# EAGLE design carcomputer (EAGLE 9.6.2)
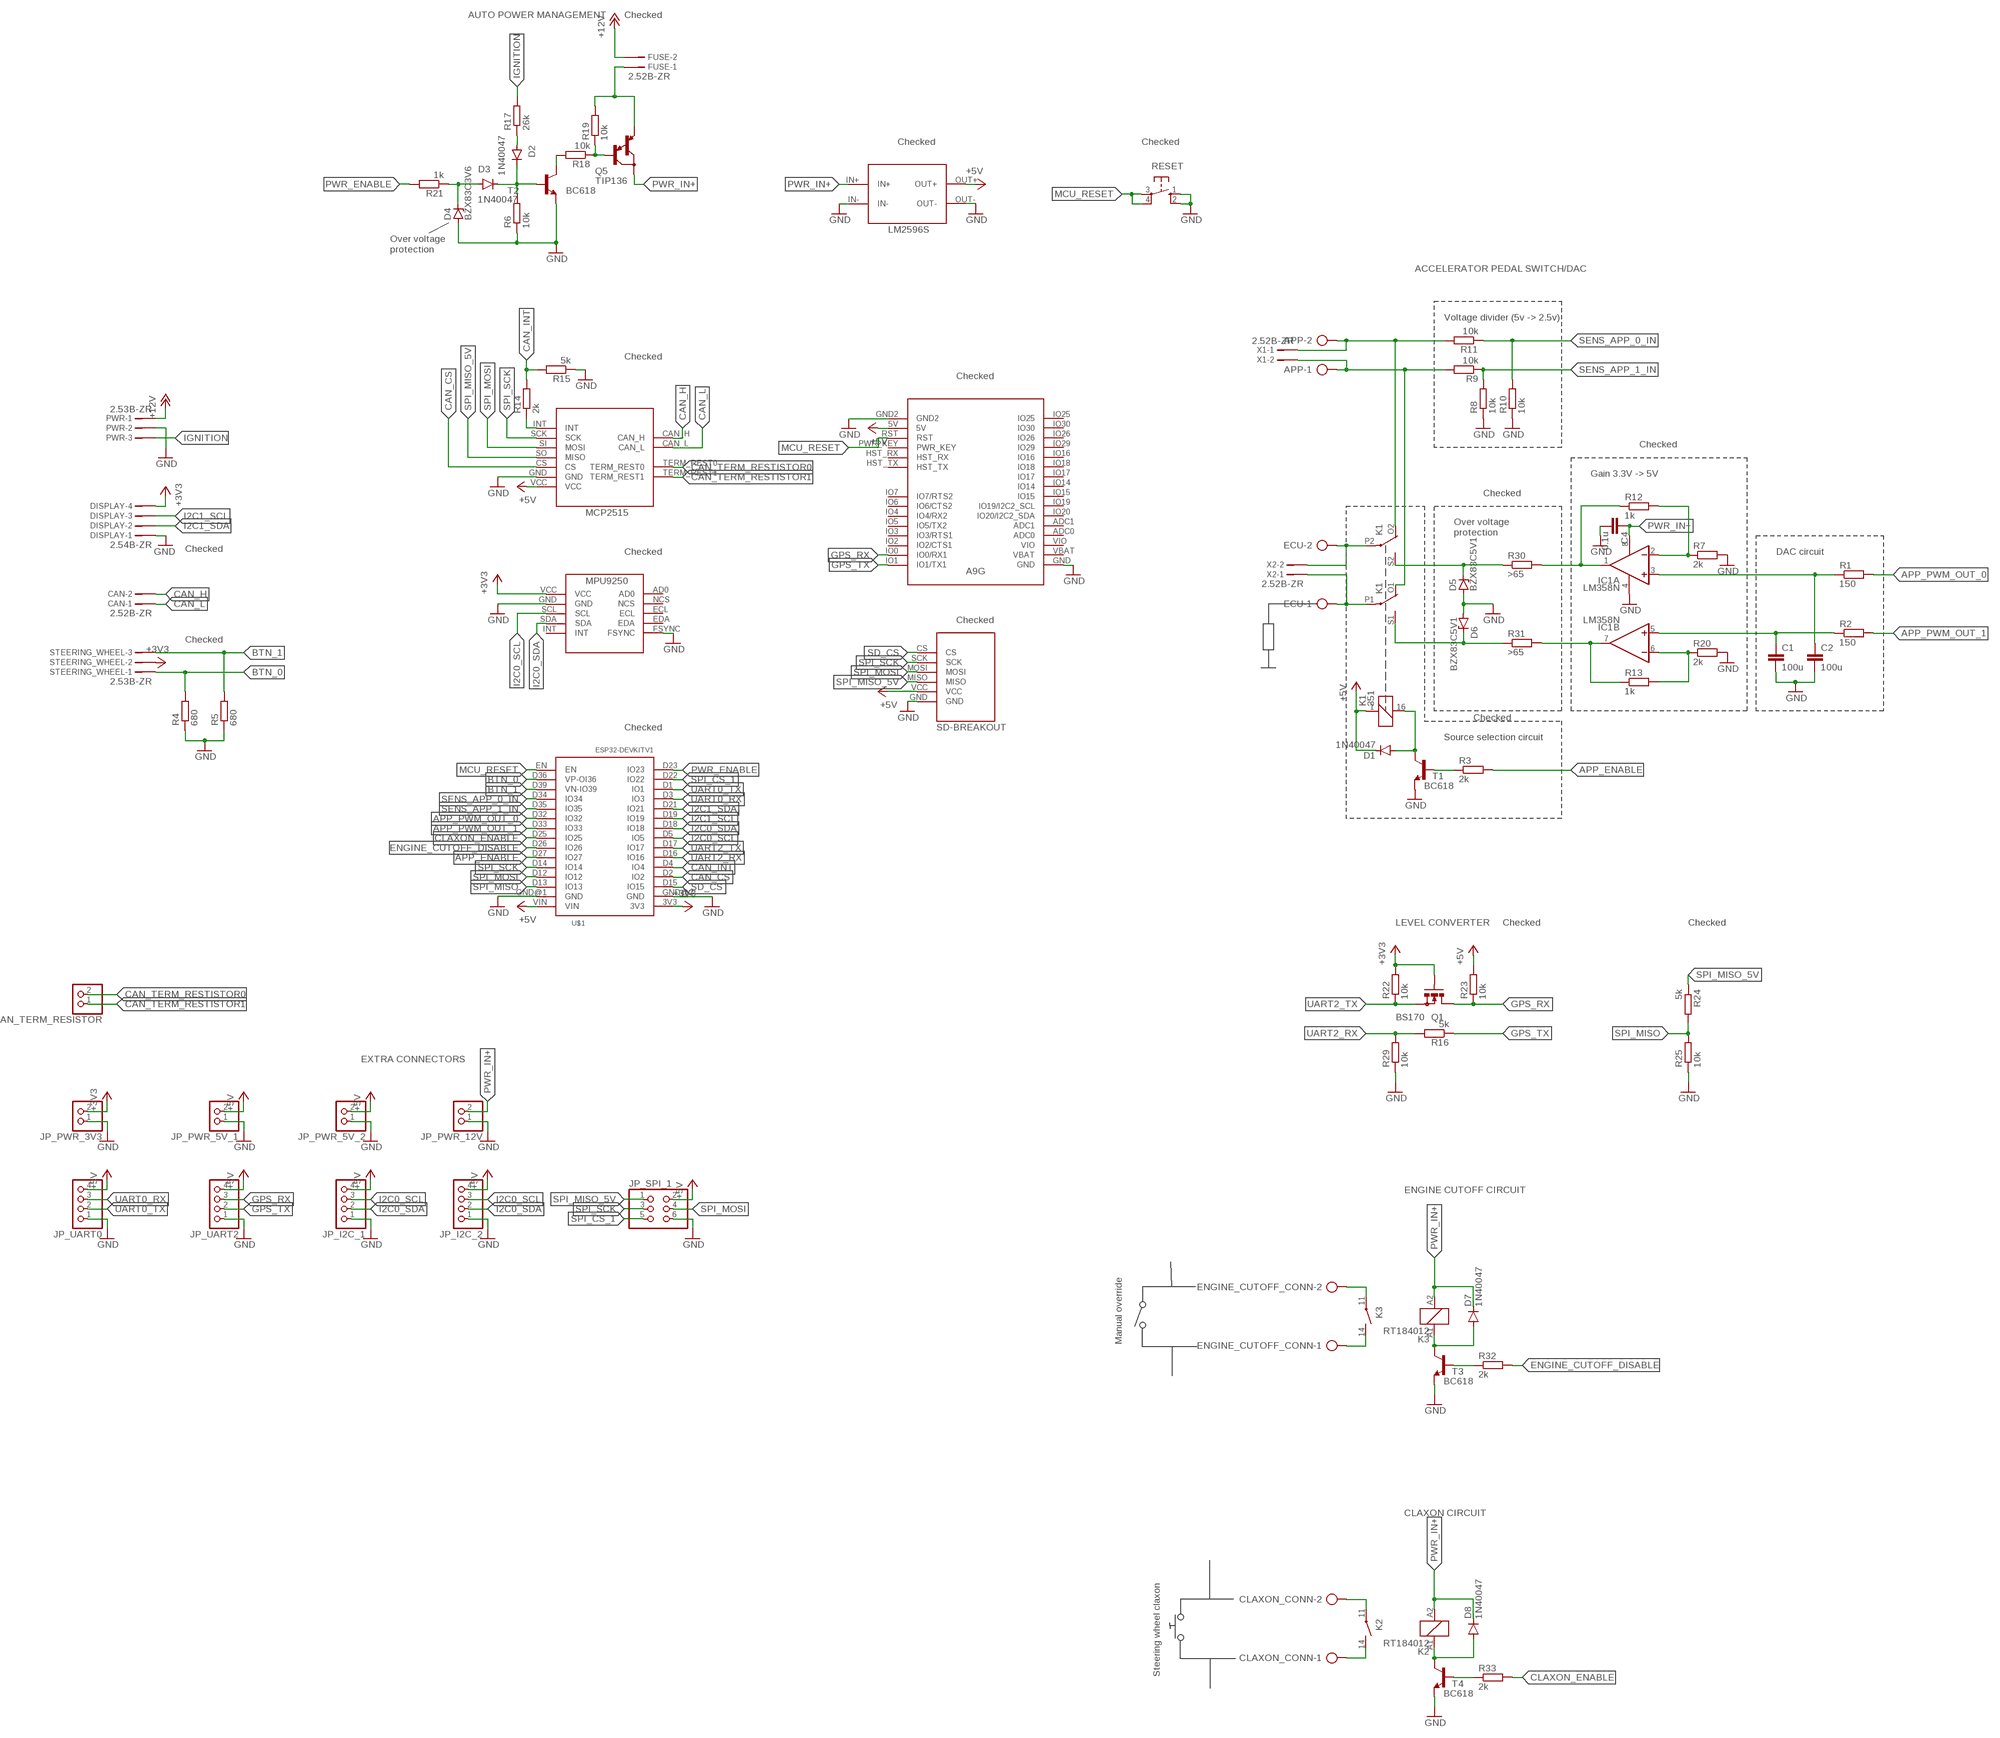
[diagram p0: schematic, sheet 1]

## Parts
APP  AK300/2  [AK300/2]
C1  100u  C-EU025-050X050  [C025-050X050]
C2  100u  C-EU025-050X050  [C025-050X050]
C4  0.1u  C-EU025-050X050  [C025-050X050]
CAN  2.52B-ZR  [B2B-ZR2.5]
CAN_TERM_RESISTOR  PINHD-1X2  [1X02]
CLAXON_CONN  AK300/2  [AK300/2]
D1  1N40047  [DO41-7.6]
D2  1N40047  [DO41-7.6]
D3  1N40047  [DO41-7.6]
D4  BZX83C3V6  BZX857  [DO41Z7.6]
D5  BZX83C5V1  BZX857  [DO41Z7.6]
D6  BZX83C5V1  BZX857  [DO41Z7.6]
D7  1N40047  [DO41-7.6]
D8  1N40047  [DO41-7.6]
DISPLAY  2.54B-ZR  [B4B-ZR2.5]
ECU  AK300/2  [AK300/2]
ENGINE_CUTOFF_CONN  AK300/2  [AK300/2]
FUSE  2.52B-ZR  [B2B-ZR2.5]
IC1  LM358N  [DIL08]
JP_I2C_1  PINHD-1X4  [1X04]
JP_I2C_2  PINHD-1X4  [1X04]
JP_PWR_3V3  PINHD-1X2  [1X02]
JP_PWR_5V_1  PINHD-1X2  [1X02]
JP_PWR_5V_2  PINHD-1X2  [1X02]
JP_PWR_12V  PINHD-1X2  [1X02]
JP_SPI_1  PINHD-2X3  [2X03]
JP_UART0  PINHD-1X4  [1X04]
JP_UART2  PINHD-1X4  [1X04]
K1  351  [351]
K2  RT184012  [RT-N/O12A3.5]
K3  RT184012  [RT-N/O12A3.5]
PWR  2.53B-ZR  [B3B-ZR2.5]
Q1  BS170  [SOT54E]
Q5  TIP136  [TO220]
R1  150  R-EU_0309/10  [0309/10]
R2  150  R-EU_0309/10  [0309/10]
R3  2k  R-EU_0207/7  [0207/7]
R4  680  R-EU_0207/7  [0207/7]
R5  680  R-EU_0207/7  [0207/7]
R6  10k  R-EU_0207/7  [0207/7]
R7  2k  R-EU_0207/7  [0207/7]
R8  10k  R-EU_0207/7  [0207/7]
R9  10k  R-EU_0309/10  [0309/10]
R10  10k  R-EU_0207/7  [0207/7]
R11  10k  R-EU_0309/10  [0309/10]
R12  1k  R-EU_0207/7  [0207/7]
R13  1k  R-EU_0207/7  [0207/7]
R14  2k  R-EU_0309/10  [0309/10]
R15  5k  R-EU_0207/7  [0207/7]
R16  5k  R-EU_0207/7  [0207/7]
R17  26k  R-EU_0207/7  [0207/7]
R18  10k  R-EU_0207/7  [0207/7]
R19  10k  R-EU_0207/7  [0207/7]
R20  2k  R-EU_0207/7  [0207/7]
R21  1k  R-EU_0309/10  [0309/10]
R22  10k  R-EU_0207/7  [0207/7]
R23  10k  R-EU_0207/7  [0207/7]
R24  5k  R-EU_0207/7  [0207/7]
R25  10k  R-EU_0207/7  [0207/7]
R29  10k  R-EU_0207/7  [0207/7]
R30  >65  R-EU_0207/7  [0207/7]
R31  >65  R-EU_0207/7  [0207/7]
R32  2k  R-EU_0309/10  [0309/10]
R33  2k  R-EU_0309/10  [0309/10]
RESET  10-XX  [B3F-10XX]
STEERING_WHEEL  2.53B-ZR  [B3B-ZR2.5]
T1  BC618  [TO92-EBC]
T2  BC618  [TO92-EBC]
T3  BC618  [TO92-EBC]
T4  BC618  [TO92-EBC]
U$1  ESP32DEVKITV1  [ESP32-DEVKITV1]
U$2  MCP2515_DEVBOARDINVERTED  [MCP2515_DEVBOARD_INVERTED]
U$3  MPU9250_BREAKOUT  [MPU9250_BREAKOUT]
U$4  LM2596S  [LM2596S]
U$5  HKD-MICRO-SD-BREAKOUTH  [HKD-MICRO-SD-BREAKOUT]
U$6  A9G  [A9G]
X1  2.52B-ZR  [B2B-ZR2.5]
X2  2.52B-ZR  [B2B-ZR2.5]

## Nets
+3V3: DISPLAY.4 JP_PWR_3V3.2 Q1.G R22.2 STEERING_WHEEL.2 U$1.3V3 U$3.VCC
+5V: D1.C JP_I2C_1.4 JP_I2C_2.4 JP_PWR_5V_1.2 JP_PWR_5V_2.2 JP_SPI_1.2 JP_UART0.4 JP_UART2.4 K1.1 R23.2 U$1.VIN U$2.VCC U$4.OUT+ U$5.VCC U$6.5V
+12V: FUSE.2 PWR.1
APP_0_IN: APP.2 K1.O2(3:O) R11.2 X1.1
APP_1_IN: APP.1 K1.O1(2:O) R9.2 X1.2
APP_ENABLE: R3.2 U$1.D27(IO27)
APP_PWM_OUT_0: R1.2 U$1.D32(IO32)
APP_PWM_OUT_1: R2.2 U$1.D33(IO33)
BTN_0: R4.2 STEERING_WHEEL.1 U$1.D36(VP-OI36)
BTN_1: R5.2 STEERING_WHEEL.3 U$1.D39(VN-IO39)
CAN_CS: U$1.D2(IO2) U$2.CS
CAN_H: CAN.2 U$2.CAN_H
CAN_INT: R14.2 R15.2 U$1.D4(IO4)
CAN_L: CAN.1 U$2.CAN_L
CAN_TERM_RESTISTOR0: CAN_TERM_RESISTOR.2 U$2.TERM_REST0
CAN_TERM_RESTISTOR1: CAN_TERM_RESISTOR.1 U$2.TERM_REST1
CLAXON_ENABLE: R33.2 U$1.D25(IO25)
ENGINE_CUTOFF_DISABLE: R32.2 U$1.D26(IO26)
GND: C1.2 C2.2 C4.2 D4.A D5.A D6.A DISPLAY.1 IC1.4(P:V-) JP_I2C_1.1 JP_I2C_2.1 JP_PWR_3V3.1 JP_PWR_5V_1.1 JP_PWR_5V_2.1 JP_PWR_12V.1 JP_SPI_1.6 JP_UART0.1 JP_UART2.1 PWR.2 R4.1 R5.1 R6.1 R7.2 R8.1 R10.1 R15.1 R20.2 R25.1 R29.1 RESET.1(S) RESET.2(S1) T1.E T2.E T3.E T4.E U$1.GND@1(GND) U$1.GND@2(GND) U$2.GND U$3.FSYNC U$3.GND U$4.IN- U$4.OUT- U$5.GND U$6.GND U$6.GND2
GPS_RX: JP_UART2.3 Q1.D R23.1 U$6.IO0(IO0/RX1)
GPS_TX: JP_UART2.2 R16.1 U$6.IO1(IO1/TX1)
I2C0_SCL: JP_I2C_1.3 JP_I2C_2.3 U$1.D5(IO5) U$3.SCL
I2C0_SDA: JP_I2C_1.2 JP_I2C_2.2 U$1.D18(IO18) U$3.SDA
I2C1_SCL: DISPLAY.3 U$1.D19(IO19)
I2C1_SDA: DISPLAY.2 U$1.D21(IO21)
IGNITION: PWR.3 R17.2
MCU_RESET: RESET.3(P) RESET.4(P1) U$1.EN U$6.RST
N$1: D1.A K1.16 T1.C
N$2: R3.1 T1.B
N$3: D6.C K1.S1(2:S) R31.1
N$4: IC1.1(A:OUT) R12.1 R30.2
N$5: D2.C D3.C R6.2 T2.B
N$6: ECU.2 K1.P2(3:P) X2.2
N$7: ECU.1 K1.P1(2:P) X2.1
N$8: C2.1 IC1.3(A:+IN) R1.1
N$9: C1.1 IC1.5(B:+IN) R2.1
N$10: R14.1 U$2.INT
N$11: D3.A D4.C R21.1
N$12: D2.A R17.1
N$13: IC1.2(A:-IN) R7.1 R12.2
N$14: Q5.1(B) R18.1 R19.1
N$15: R18.2 T2.C
N$16: IC1.6(B:-IN) R13.2 R20.1
N$17: D5.C K1.S2(3:S) R30.1
N$18: IC1.7(B:OUT) R13.1 R31.2
N$19: ENGINE_CUTOFF_CONN.2 K3.11(2:P)
N$20: ENGINE_CUTOFF_CONN.1 K3.14(2:S)
N$21: FUSE.1 Q5.3(E) R19.2
N$22: D7.A K3.A1 T3.C
N$23: D8.A K2.A1 T4.C
N$25: R33.1 T4.B
N$26: R32.1 T3.B
N$27: CLAXON_CONN.2 K2.11(2:P)
N$28: CLAXON_CONN.1 K2.14(2:S)
PWR_ENABLE: R21.2 U$1.D23(IO23)
PWR_IN+: C4.1 D7.C D8.C IC1.8(P:V+) JP_PWR_12V.2 K2.A2 K3.A2 Q5.2(C) U$4.IN+
SD_CS: U$1.D15(IO15) U$5.CS
SENS_APP_0_IN: R10.2 R11.1 U$1.D34(IO34)
SENS_APP_1_IN: R8.2 R9.1 U$1.D35(IO35)
SPI_CS_1: JP_SPI_1.5 U$1.D22(IO22)
SPI_MISO: R24.2 R25.2 U$1.D13(IO13)
SPI_MISO_5V: JP_SPI_1.1 R24.1 U$2.SO(MISO) U$5.MISO
SPI_MOSI: JP_SPI_1.4 U$1.D12(IO12) U$2.SI(MOSI) U$5.MOSI
SPI_SCK: JP_SPI_1.3 U$1.D14(IO14) U$2.SCK U$5.SCK
UART0_RX: JP_UART0.3 U$1.D3(IO3)
UART0_TX: JP_UART0.2 U$1.D1(IO1)
UART2_RX: R16.2 R29.2 U$1.D16(IO16)
UART2_TX: Q1.S R22.1 U$1.D17(IO17)
Unconnected: U$3.AD0 U$3.ECL U$3.EDA U$3.INT U$3.NCS U$6.ADC0 U$6.ADC1 U$6.HST_RX U$6.HST_TX U$6.IO2(IO2/CTS1) U$6.IO3(IO3/RTS1) U$6.IO4(IO4/RX2) U$6.IO5(IO5/TX2) U$6.IO6(IO6/CTS2) U$6.IO7(IO7/RTS2) U$6.IO14 U$6.IO15 U$6.IO16 U$6.IO17 U$6.IO18 U$6.IO19(IO19/I2C2_SCL) U$6.IO20(IO20/I2C2_SDA) U$6.IO25 U$6.IO26 U$6.IO29 U$6.IO30 U$6.PWR_KEY U$6.VBAT U$6.VIO

## Notes on the sheet
- AUTO POWER MANAGEMENT | Checked
- Checked | Checked
- Over voltage
  protection
- ACCELERATOR PEDAL SWITCH/DAC
- Voltage divider (5v -> 2.5v)
- Checked
- Checked
- Checked
- Gain 3.3V -> 5V
- Checked
- Over voltage
  protection
- Checked
- Checked | DAC circuit
- Checked
- Checked
- Checked
- Checked
- Source selection circuit
- LEVEL CONVERTER | Checked | Checked
- EXTRA CONNECTORS
- ENGINE CUTOFF CIRCUIT
- Manual override
- CLAXON CIRCUIT
- Steering wheel claxon

## Library data of the parts
APP CLAXON_CONN ECU ENGINE_CUTOFF_CONN = con-ptr500-custom:AK300/2: CONNECTOR; OC_FARNELL: unknown; OC_NEWARK: unknown
C1 C2 C4 = rcl:C-EU: CAPACITOR, European symbol; SPICEPREFIX: C
CAN FUSE X1 X2 = con-jst-custom:?2B-ZR: ZH CONNECTOR 1.5 mm, 4 pin 1 row Source: http://www.jst.com .. eZH.pdf
CAN_TERM_RESISTOR JP_PWR_3V3 JP_PWR_5V_1 JP_PWR_5V_2 JP_PWR_12V = pinhead:PINHD-1X2: PIN HEADER
D1-D3 D7 D8 = diode-custom:1N4004: DIODE general purpose rectifier, 1 A
D4-D6 = diode-custom:BZX85: Z DIODE
DISPLAY = con-jst-custom:?4B-ZR: ZH CONNECTOR 1.5 mm, 4 pin 1 row Source: http://www.jst.com .. eZH.pdf
IC1 = linear:LM358: OP AMP also LM158; LM258; LM2904 Source: http://cache.national.com/ds/LM/LM158.pdf
JP_I2C_1 JP_I2C_2 JP_UART0 JP_UART2 = pinhead:PINHD-1X4: PIN HEADER
JP_SPI_1 = pinhead:PINHD-2X3: PIN HEADER
K1 = relay:351: RELAY 2 x switch, Omron; OC_FARNELL: unknown; OC_NEWARK: unknown
K2 K3 = relay:RT?*: Power PCB Relay SCHRACK 1 pole 12 / 16 A, DC- or AC-coil Source: http://www.schrack.com/.. 5819.pdf; MF: TYCO ELECTRONICS; MPN: RT184012; OC_FARNELL: unknown; OC_NEWARK: 08H3731
PWR STEERING_WHEEL = con-jst-custom:?3B-ZR: ZH CONNECTOR 1.5 mm, 4 pin 1 row Source: http://www.jst.com .. eZH.pdf
Q1 = transistor-small-signal:BS170: N-CHANNEL MOS FET
Q5 = transistor-pnp:TIP136: PNP Darlington Transistor
R1-R25 R29-R33 = rcl:R-EU_: RESISTOR, European symbol; SPICEPREFIX: R
RESET = switch-omron:10-XX: OMRON SWITCH; MPN: B3F-1000; OC_FARNELL: 176432; OC_NEWARK: 36M3542
T1-T4 = transistor-npn:BC618*: NPN Transistor
U$1 = ESP32-DEVKITV1:ESP32DEVKITV1
U$2 = MCP2515:MCP2515_DEVBOARD
U$3 = MPU9250:MPU9250_BREAKOUT
U$4 = PSU:LM2596S
U$5 = sd-mmc:HKD-MICRO-SD-BREAKOUT
U$6 = A9:A9G

## Board
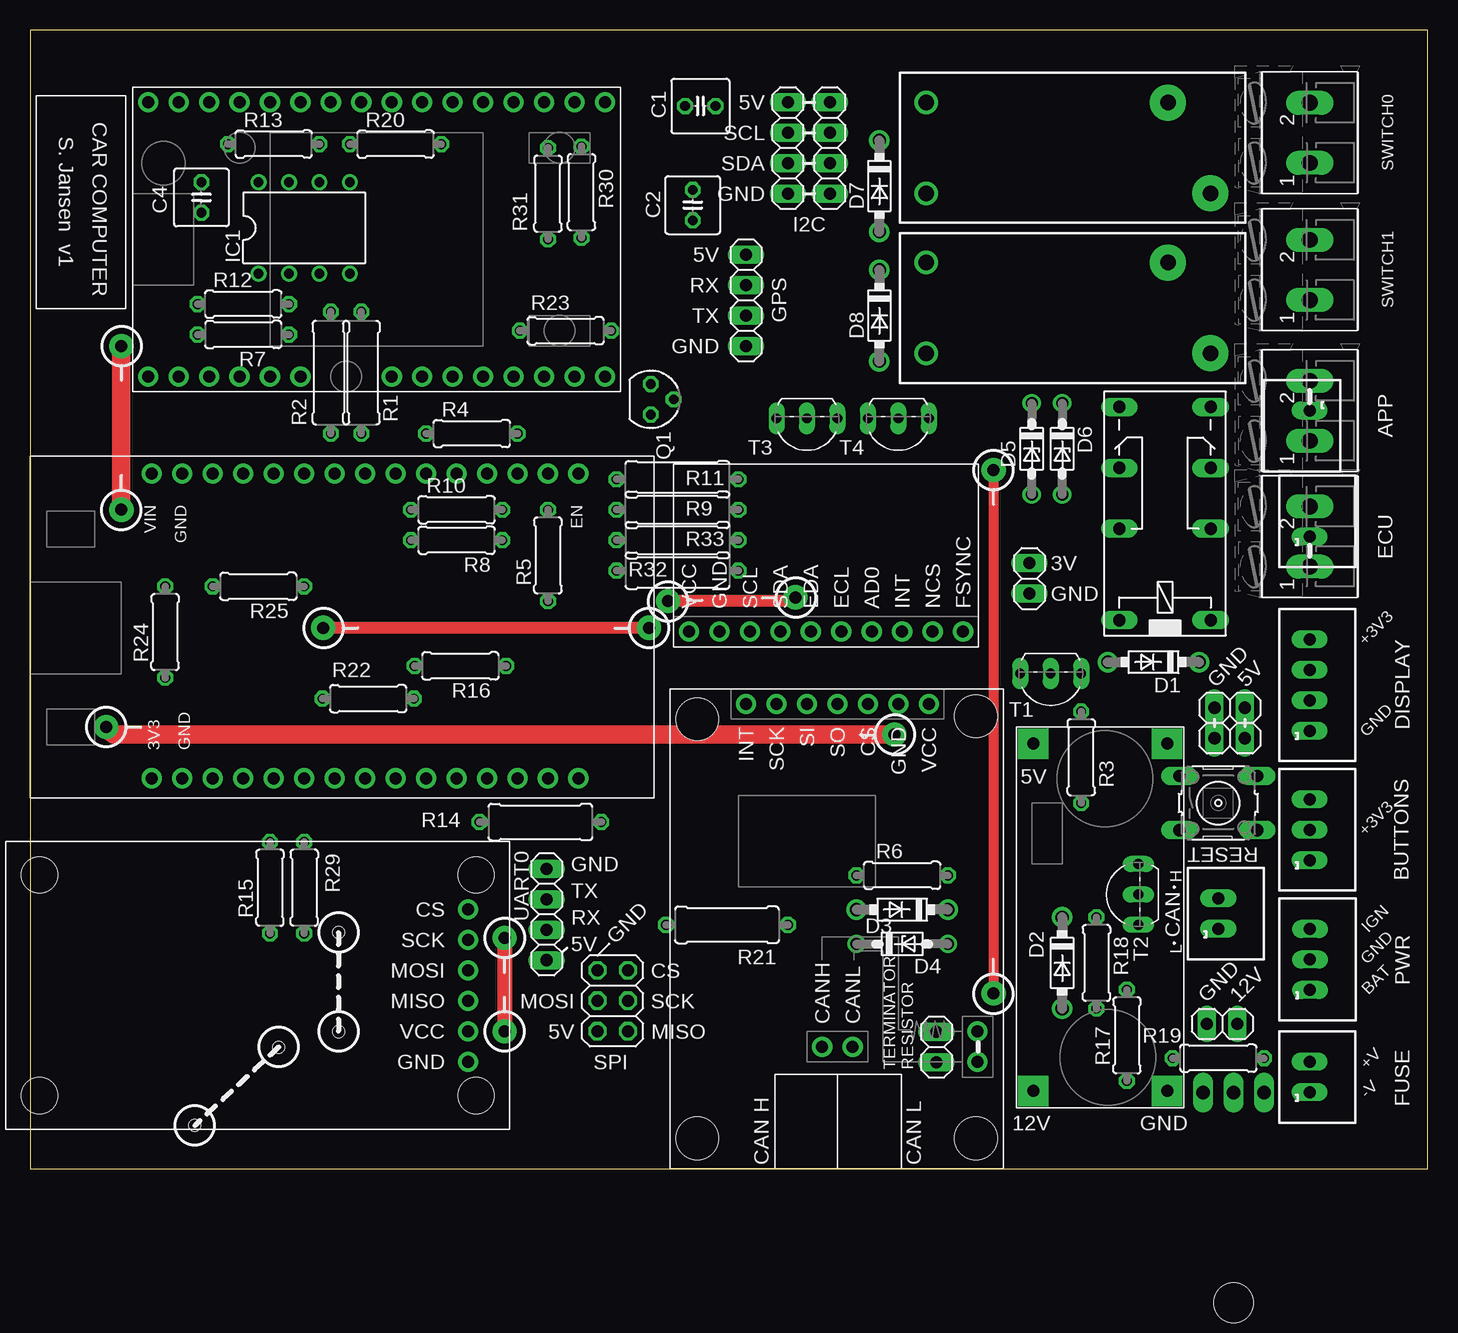
[diagram p1: board, top side]
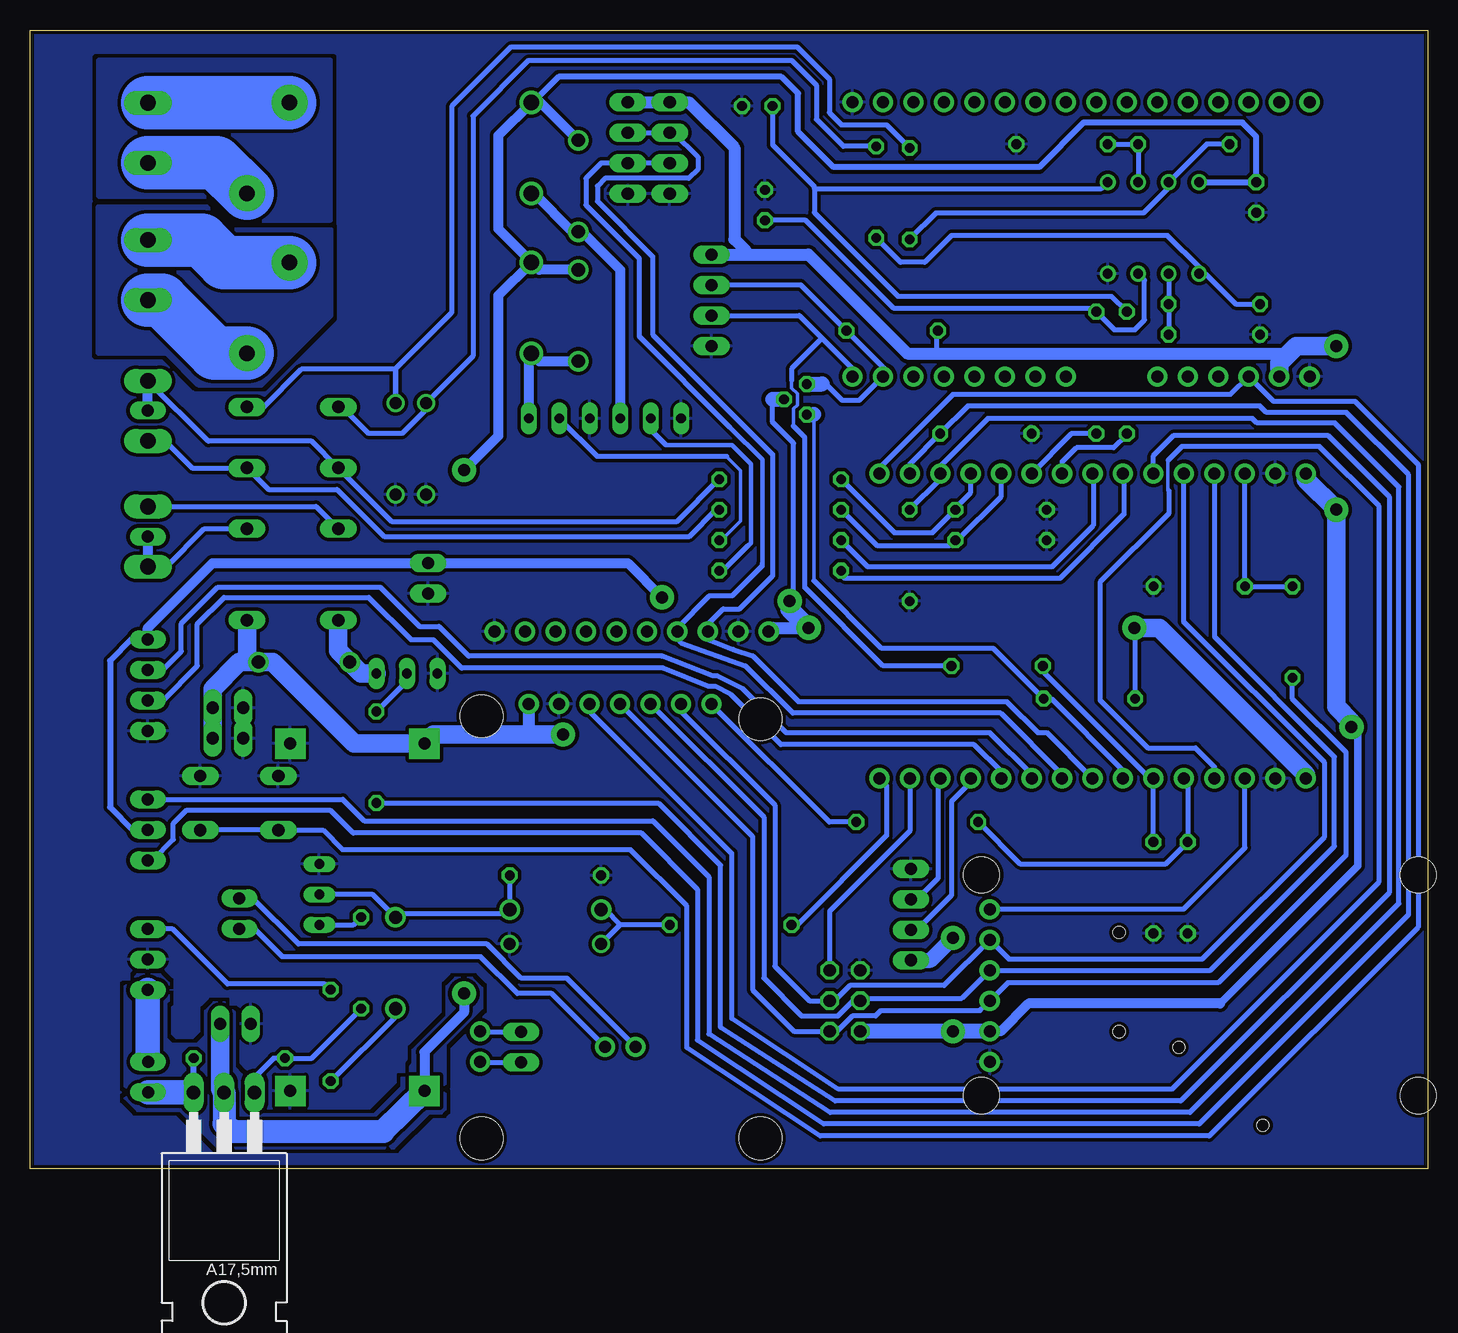
[diagram p2: board, bottom side, seen from below]

Size 116.51 x 94.92 mm. Coordinates in mm from the lower left corner, seen from the top.
Outline: 0,0 116.51,0 116.51,94.92 0,94.92 0,0
Copper layers (1*16): Top 0.035mm / dielectric 1.5mm / Bottom 0.035mm
Design rules "default *": minimum track width 8mil, minimum drill 0.3mm, track to track 12mil, track to pad 8mil, pad to pad 10mil, via to via 10mil, smd to smd 6mil, copper to edge 8mil, drill to drill 10mil, minimum pad ring 10mil, minimum via ring 20mil, stop-mask expansion 4mil, vias tented up to drill 0mil, thermal gap 10mil
Holes 1 mm at 25.72,19.69 25.72,11.43 20.74,10.11 13.73,3.61

### Footprints (pad centres in the part's own frame; a part is rotated, then mirrored left to right if it is on the bottom)
AK300/2 = drill 1.321 long: 1 -2.515,0; 2 2.489,0
C025-050X050 = drill 0.813 octagon: 1 -1.27,0; 2 1.27,0
B2B-ZR2.5 = drill 1 pad 1.422 long: 1 -1.285,0; 2 1.257,0
1X02 = drill 1.016 long: 1 -1.27,0; 2 1.27,0
DO41-7.6 = drill 1.1 pad 1.7: A 3.81,0; C -3.81,0
DO41Z7.6 = drill 1: A 3.81,0; C -3.81,0
B4B-ZR2.5 = drill 1 pad 1.422 long: 1 -3.825,0; 2 -1.283,0; 3 1.257,0; 4 3.797,0
DIL08 = drill 0.813 pad 1.27: 1 -3.81,-3.81; 2 -1.27,-3.81; 3 1.27,-3.81; 4 3.81,-3.81; 5 3.81,3.81; 6 1.27,3.81; 7 -1.27,3.81; 8 -3.81,3.81
1X04 = drill 1.016 long: 1 -3.81,0; 2 -1.27,0; 3 1.27,0; 4 3.81,0
2X03 = drill 1.016 octagon: 1 -2.54,-1.27; 2 -2.54,1.27; 3 0,-1.27; 4 0,1.27; 5 2.54,-1.27; 6 2.54,1.27
351 = drill 1.016 long: 1 -3.81,-3.81; 16 -3.81,3.81; O1 8.89,-3.81; O2 8.89,3.81; P1 3.81,-3.81; P2 3.81,3.81; S1 13.97,-3.81; S2 13.97,3.81
RT-N/O12A3.5 = drill 1.3 pad 3: 11 7.56,3.78; 14 11.1,-3.78 | drill 1.3: A1 -12.6,-3.78; A2 -12.6,3.78
B3B-ZR2.5 = drill 1 pad 1.422 long: 1 -2.555,0; 2 -0.013,0; 3 2.527,0
SOT54E = drill 0.813 octagon: D -1.27,0; G 0,1.905; S 1.27,0
TO220 = drill 1.118 long: 1 -2.54,-6.35; 2 0,-6.35; 3 2.54,-6.35 | hole 3.302: 0,11.176
0309/10 = drill 0.813 octagon: 1 -5.08,0; 2 5.08,0
0207/7 = drill 0.813 octagon: 1 -3.81,0; 2 3.81,0
B3F-10XX = drill 1.016 long: 1 -3.251,2.261; 2 3.251,2.261; 3 -3.251,-2.261; 4 3.251,-2.261
TO92-EBC = drill 0.813 long: B 0,-1.27; C -2.54,-1.27; E 2.54,-1.27
ESP32-DEVKITV1 = drill 1 pad 1.676: 3V3 -15.25,-12.54; D1 15.23,-12.54; D2 -7.63,-12.54; D3 12.69,-12.54; D4 -5.09,-12.54; D5 2.53,-12.54; D12 -7.63,12.865; D13 -10.17,12.865; D14 -5.09,12.865; D15 -10.17,-12.54; D16 -2.55,-12.54; D17 -0.01,-12.54; D18 5.07,-12.54; D19 7.61,-12.54; D21 10.15,-12.54; D22 17.77,-12.54; D23 20.31,-12.54; D25 2.53,12.865; D26 -0.01,12.865; D27 -2.55,12.865; D32 7.61,12.865; D33 5.07,12.865; D34 12.69,12.865; D35 10.15,12.865; D36 17.77,12.865; D39 15.23,12.865; EN 20.31,12.865; GND@1 -12.71,12.865; GND@2 -12.71,-12.54; VIN -15.25,12.865
MCP2515_DEVBOARD_INVERTED = drill 1 pad 1.676: CAN_H 9.525,-1.27; CAN_L 9.525,1.27; CS -19.05,2.54; GND -19.05,5.08; INT -19.05,-7.62; SCK -19.05,-5.08; SI -19.05,-2.54; SO -19.05,0; TERM_REST0 8.255,11.684; TERM_REST1 10.795,11.684; VCC -19.05,7.62 | hole 3.556: -17.78,-11.684; 17.145,-11.684; 17.145,11.557; -18.034,11.557
MPU9250_BREAKOUT = drill 1 pad 1.676: AD0 -6.35,-3.81; ECL -6.35,-1.27; EDA -6.35,1.27; FSYNC -6.35,-11.43; GND -6.35,8.89; INT -6.35,-6.35; NCS -6.35,-8.89; SCL -6.35,6.35; SDA -6.35,3.81; VCC -6.35,11.43
LM2596S = drill 1 pad 2.54 square: IN+ -13.843,6.223; IN- -13.843,-4.953; OUT+ 15.113,6.223; OUT- 15.113,-4.953
HKD-MICRO-SD-BREAKOUT = drill 1 pad 1.676: CS -17.52,-6.32; GND -17.52,6.38; MISO -17.52,1.3; MOSI -17.52,-1.24; SCK -17.52,-3.78; VCC -17.52,3.84 | hole 2.997: -18.2,9.2; -18.2,-9.2; 18.2,9.2; 18.2,-9.2
A9G = drill 1 pad 1.676: 5V -11.43,16.51; ADC0 11.43,-11.43; ADC1 11.43,-8.89; GND 11.43,-19.05; GND2 -11.43,19.05; HST_RX -11.43,8.89; HST_TX -11.43,6.35; IO0 -11.43,-16.51; IO1 -11.43,-19.05; IO2 -11.43,-13.97; IO3 -11.43,-11.43; IO4 -11.43,-6.35; IO5 -11.43,-8.89; IO6 -11.43,-3.81; IO7 -11.43,-1.27; IO14 11.43,1.27; IO15 11.43,-1.27; IO16 11.43,8.89; IO17 11.43,3.81; IO18 11.43,6.35; IO19 11.43,-3.81; IO20 11.43,-6.35; IO25 11.43,19.05; IO26 11.43,13.97; IO29 11.43,11.43; IO30 11.43,16.51; PWR_KEY -11.43,11.43; RST -11.43,13.97; VBAT 11.43,-16.51; VIO 11.43,-13.97

### Placement (x,y rotation side)
APP  106.68,63.18 90 top
C1  55.88,88.58 0 top
C2  55.25,80.33 90 top
C4  14.29,80.96 270 top
CAN  99.06,21.27 90 top
CAN_TERM_RESISTOR  75.56,10.13 90 top
CLAXON_CONN  106.68,74.93 90 top
D1  93.66,42.23 180 top
D2  86.04,17.14 270 top
D3  72.71,21.59 180 top
D4  72.71,18.73 0 top
D5  83.5,60.01 270 top
D6  86.04,60.01 270 top
D7  70.8,81.91 270 top
D8  70.8,71.12 270 top
DISPLAY  106.68,40.32 90 top
ECU  106.68,52.7 90 top
ENGINE_CUTOFF_CONN  106.68,86.36 90 top
FUSE  106.67,7.65 90 top
IC1  22.86,78.42 0 top
JP_I2C_1  63.18,85.09 90 top
JP_I2C_2  66.67,85.09 90 top
JP_PWR_3V3  83.32,49.21 90 top
JP_PWR_5V_1  100.01,35.88 0 top
JP_PWR_5V_2  100.01,38.42 0 top
JP_PWR_12V  99.38,12.06 0 top
JP_SPI_1  48.58,14 90 top
JP_UART0  43.07,21.18 270 top
JP_UART2  59.69,72.39 90 top
K1  94.61,49.53 90 top
K2  87.31,71.75 0 top
K3  87.31,85.09 0 top
PWR  106.69,17.45 90 top
Q1  51.75,64.13 270 top
Q5  100.33,0 180 bottom
R1  27.62,66.36 270 top
R2  25.08,66.36 270 top
R3  87.63,34.29 270 top
R4  36.83,61.28 0 top
R5  43.18,51.12 90 top
R6  72.71,24.45 0 top
R7  17.78,69.53 180 top
R8  35.56,52.39 0 top
R9  53.98,54.93 0 top
R10  35.56,54.93 0 top
R11  53.98,57.47 0 top
R12  17.78,72.07 0 top
R13  20.32,85.41 0 top
R14  42.55,28.89 180 top
R15  20,23.42 90 top
R16  35.88,41.91 180 top
R17  91.44,11.11 90 top
R18  88.9,17.14 90 top
R19  99.06,9.21 0 top
R20  30.48,85.41 0 top
R21  58.1,20.32 180 top
R22  28.19,39.18 180 top
R23  44.64,69.85 180 top
R24  11.26,44.73 90 top
R25  19.04,48.54 180 top
R29  22.86,23.42 90 top
R30  45.97,81.41 270 top
R31  43.18,81.28 270 top
R32  53.98,49.85 180 top
R33  53.98,52.39 180 top
RESET  99.06,30.48 0 top
STEERING_WHEEL  106.68,28.26 90 top
T1  85.09,40.01 180 top
T2  91.12,22.86 90 top
T3  64.77,61.28 180 top
T4  72.39,61.28 180 top
U$1  25.4,45.09 0 top
U$2  67.31,19.69 270 top
U$3  66.36,51.12 90 top
U$4  89.85,20.32 90 top
U$5  18.99,15.29 180 top
U$6  28.89,77.47 90 top
X1  106.68,61.91 270 top
X2  106.68,53.98 90 top

### Tracks (layer width: path | path; a pad name or v marks a point on that pad's centre or on a via)
+3V3  (via drill 1)
  Top 1.016: v51.59,45.09 v24.45,45.09 | v63.82,47.62 63.5,47.31 v53.18,47.31
  Bottom 0.406: R22.2 24.38,45.02 v24.45,45.09 | v53.18,47.31 52.86,47.62 52.86,60.48 54.61,62.23 54.61,64.13
  Bottom 0.508: STEERING_WHEEL.2 107.95,28.24 109.84,30.14 109.84,42.33 108.04,44.13 106.69,44.13 DISPLAY.4
  Bottom 0.813: v63.82,47.62 66.68,50.48 JP_PWR_3V3.2 101.28,50.48 106.68,45.09 DISPLAY.4
  Bottom 1.016: U$3.VCC 54.61,45.09 v51.59,45.09
  Bottom 1.27: 54.61,64.13 Q1.G
  Bottom 1.524: v53.18,47.31 53.18,46.67 v51.59,45.09 | U$1.3V3 10.15,32.86 22.37,45.09 v24.45,45.09
+5V  (via drill 1)
  Top 1.27: v39.56,19.24 v39.56,11.44
  Top 1.524: v7.62,54.93 v7.62,68.58 | v72.07,36.2 6.99,36.2 v6.35,36.83
  Bottom 0.406: R23.2 40.96,69.72 40.96,67.94
  Bottom 0.61: 17.29,13.77 5.8,25.25 5.8,36.28 v6.35,36.83
  Bottom 0.813: U$5.VCC 35.59,11.45 33.28,13.77 17.29,13.77
  Bottom 1.016: JP_I2C_2.4 JP_I2C_1.4 61.59,88.9 57.79,85.09 57.79,77.47 56.83,76.52 56.83,76.2 | JP_UART2.4 56.83,76.2 | 56.83,76.2 51.63,76.2 43.37,67.94 40.96,67.94 11.75,67.94 11.67,67.86 | U$2.VCC 74.93,36.2
  Bottom 1.27: U$5.VCC v39.55,11.45 v39.56,11.44 47.29,11.44 JP_SPI_1.2 | JP_UART0.4 41.43,17.37 v39.56,19.24
  Bottom 1.524: U$6.5V 12.38,67.15 11.67,67.86 10.95,68.58 v7.62,68.58 | v72.07,36.2 74.93,36.2 82.87,36.2 U$4.OUT+ 89.5,35.43 96.29,42.23 D1.C | v6.35,36.83 6.35,37.24 7.62,38.51 v7.62,54.93 10.15,57.46 U$1.VIN | D1.C 99.06,42.23 101.28,40.01 JP_PWR_5V_2.2 JP_PWR_5V_1.2 | D1.C 98.11,42.23 98.42,42.55 K1.1
+12V
  Bottom 0.406: 106.68,9.52 106.67,9.51 FUSE.2
  Bottom 2.032: PWR.1 106.69,9.54 106.68,9.52
APP_0_IN
  Bottom 0.406: R11.2 62.56,53.96 86.35,53.96 K1.O2 93.03,60.64 101.65,60.64 APP.2
  Bottom 0.813: X1.1 APP.2
APP_1_IN
  Bottom 0.406: R9.2 59.32,54.93 61.54,52.7 86.98,52.7 90.91,56.63 96.63,56.63 K1.O1 103.01,58.42 105.26,60.67 APP.1 X1.2
APP_ENABLE
  Bottom 0.406: R3.2 64.13,30.48 58.94,25.29 58.94,11.76 49.39,5.64 20.58,5.64 3.21,23 3.21,56.02 8.33,61.14 21.15,61.14 22.85,59.44 U$1.D27
APP_PWM_OUT_0
  Bottom 0.406: R1.2 29.68,61.28 U$1.D32
APP_PWM_OUT_1
  Bottom 0.406: U$1.D33 30.47,58.9 29.26,60.11 26.19,60.11 25.08,61.21 R2.2
BTN_0
  Bottom 0.406: U$1.D36 43.17,58.75 R4.2 38.34,63.58 13.97,63.58 13.44,63.05 6.78,63.05 1.57,57.84 1.57,21.18 19.03,3.72 50.35,3.72 60.88,10.7 60.88,23.3 65.55,27.96 89.56,27.96 91.44,29.84 103.5,29.84 104.56,28.79 104.56,27.43 106.29,25.7 STEERING_WHEEL.1
BTN_1
  Bottom 0.406: R5.2 43.18,54.95 40.63,57.51 U$1.D39 40.63,58.59 36.67,62.55 14.61,62.55 14.22,62.17 7.73,62.17 2.39,56.83 2.39,22.1 19.81,4.67 49.81,4.67 59.91,11.22 59.91,24.31 64.59,28.99 88.65,28.99 90.44,30.78 STEERING_WHEEL.3
CAN_CS
  Bottom 0.305: 21.64,59.04 21.64,56.63 21.58,56.57
  Bottom 0.406: U$2.CS 69.85,38.12 58.01,26.29 58.01,12.51 49.09,6.62 21.33,6.62 4.04,23.91 4.04,55.22 9.03,60.21 20.47,60.21 21.64,59.04 | 21.58,56.57 21.58,54.61 27.3,48.88 27.3,39.05 23.34,35.09 19.36,35.09 17.77,33.5 U$1.D2
CAN_H
  Bottom 0.406: CAN.2 97.93,22.53 94.13,18.73 78.42,18.73 75.56,15.88 71.76,15.88 U$2.CAN_H
CAN_INT
  Bottom 0.406: R14.2 33.99,25.41 21.81,25.41 20,27.22 R15.2 20,32.24 U$1.D4
CAN_L
  Bottom 0.406: CAN.1 97.79,19.99 95.47,17.67 78.94,17.67 75.88,14.61 73.02,14.61 U$2.CAN_L
CAN_TERM_RESTISTOR0
  Bottom 0.406: U$2.TERM_REST0 78.97,11.4 CAN_TERM_RESISTOR.2
CAN_TERM_RESTISTOR1
  Bottom 0.406: U$2.TERM_REST1 78.97,8.87 CAN_TERM_RESISTOR.1
CLAXON_ENABLE
  Bottom 0.406: R33.2 46.67,50.16 31.33,50.16 27.88,53.62 27.88,57.9 U$1.D25
ENGINE_CUTOFF_DISABLE
  Bottom 0.406: U$1.D26 25.31,57.87 25.31,54.55 30.66,49.21 48.56,49.21 48.9,49.54 R32.2
GND
  pour Bottom (isolate 0.305, rank 3): -1.27,0 -1.27,94.93 117.16,94.93 117.16,0
GPS_RX
  Bottom 0.406: JP_UART2.3 58.42,73.66 58.41,73.67 52.27,73.67 R23.1 45.28,66.67 45.28,66.17 U$6.IO0 47.38,64.06 48.82,64.06 50.16,65.41 50.48,65.41
  Bottom 1.27: Q1.D 50.48,65.41
GPS_TX
  Bottom 0.305: 53.02,65.72 53.02,65.08 52.54,64.6 52.54,63.67 52.87,63.34 52.87,61.91
  Bottom 0.406: U$6.IO1 47.94,66.69 50.47,69.22 | 50.47,69.22 52.37,71.12 JP_UART2.2 | 52.87,61.91 51.91,60.95 51.91,48.43 45.39,41.91 R16.1 | 53.02,65.72 53.02,66.67 50.47,69.22
I2C0_SCL
  Bottom 0.406: JP_I2C_2.3 JP_I2C_1.3 62.85,86.36 60.83,84.35 60.83,83.29 61.58,82.55 68.58,82.55 69.22,81.91 69.22,80.64 64.61,76.04 64.61,69.53 54.61,59.53 54.61,49.42 57.35,46.67 58.74,46.67 60.01,45.4 U$3.SCL 60.01,44.16 59.97,44.12 57.9,43.28 56.25,42.75 52.42,38.92 35.06,38.92 32.49,36.35 31.74,36.35 U$1.D5
I2C0_SDA
  Bottom 0.356: 58.18,61.84 55.46,59.12 55.46,50.48
  Bottom 0.406: JP_I2C_1.2 JP_I2C_2.2 68.9,83.82 70.17,82.55 70.17,80.33 65.72,75.88 65.72,69.38 58.18,61.84 | U$1.D18 30.47,32.85 35.59,37.97 52.92,37.97 56.87,41.92 62.22,43.83 62.55,44.16 U$3.SDA 62.55,45.09 59.89,47.74 57.99,47.74 55.46,50.27 55.46,50.48
I2C1_SCL
  Bottom 0.406: U$1.D19 33.01,32.86 36.48,36.34 53.46,36.34 57.13,40.01 59.21,41.09 59.57,41.09 63.83,42.73 79.94,42.73 82.42,45.21 84.05,45.21 87.31,48.48 100.86,48.48 103.9,45.44 103.9,43.12 105.44,41.58 DISPLAY.3
I2C1_SDA
  Bottom 0.406: U$1.D21 35.55,33.09 37.82,35.36 53.92,35.36 58.12,39.55 59.42,40.23 59.98,40.23 63.7,41.72 80.52,41.72 82.9,44.1 84.74,44.1 88.26,47.62 100.33,47.62 102.55,45.4 102.55,41.91 105.42,39.04 DISPLAY.2
IGNITION
  Bottom 0.406: PWR.3 104.62,19.98 100.04,15.39 91.94,15.39 91.47,14.92 R17.2
ISO
  pour Bottom (rank 2): 91.44,92.39 110.81,92.39 110.81,81.08 101.4,81.08 99.39,79.07 91.44,79.07
  pour Bottom (rank 2): 91.44,78.3 91.44,71.12 97.27,65.29 102.44,65.29 105.09,67.94 110.81,67.94 110.81,80.21 101.8,80.21 99.89,78.3
  pour Bottom (isolate 0.203): 105.65,16.21 107.58,16.21 108.6,15.19 108.6,6.86 108.09,6.35 108.6,5.84 107.58,4.83 104.03,4.83 100.88,1.68 100.06,1.68 99.76,1.98 99.66,1.98 99.35,1.68 86.96,1.68 86.65,1.98 86.35,1.68 86.14,1.68 83.2,4.62 82.18,4.62 81.88,4.93 81.88,6.25 82.28,6.65 81.88,7.06 81.88,10.31 78.83,13.36 78.83,15.09 79.64,15.9 81.06,15.9 81.78,15.19 81.78,12.75 84.62,9.91 84.62,8.79 84.82,8.48 84.82,7.87 85.13,7.57 85.53,7.57 85.53,6.86 87.87,4.52 98.34,4.52 98.84,5.03 98.84,7.87 99.45,8.48 99.45,13.06 100.27,13.87 101.18,13.87 101.89,13.16 101.89,11.13 102.6,10.41 104.64,10.41 105.14,10.92 105.14,13.77 104.94,13.97 104.94,15.49
MCU_RESET
  Bottom 0.406: U$1.EN 45.71,58.41 39.59,64.53 16.43,64.53 U$6.RST 12.85,63.97 6.07,63.97 0.8,58.7 0.8,20.13 18.21,2.72 50.64,2.72 61.75,10.07 61.75,21.9 66.43,26.58 90.45,26.58 92.09,28.22 RESET.3 RESET.4
N$1
  Bottom 1.524: K1.16 90.81,43.18 D1.A 88.9,41.27 T1.C
N$2
  Bottom 0.406: R3.1 85.09,40.64 T1.B
N$3
  Bottom 0.406: R31.1 45.08,86.99 48.84,86.99 49.88,88.03 49.88,90.82 52.57,93.51 76.41,93.51 81.36,88.56 81.36,71.36 86.04,66.67 D6.C 86.04,66.64 93.9,66.64 97.04,63.5 K1.S1
N$4
  Bottom 0.406: R12.1 16,72.07 18.54,74.61 IC1.1 19.05,75.16 21.68,77.79 39.69,77.79 41.92,75.55 43.93,75.55 R30.2
N$5
  Bottom 0.406: R6.2 D3.C 76.84,21.27 85.72,21.27 D2.C 87.95,22.86 T2.B
N$6
  Bottom 0.406: K1.P2 92.66,55.19 ECU.2 X2.2
N$7
  Bottom 0.406: ECU.1 105.13,50.19 101.98,53.34 K1.P1
  Bottom 0.813: X2.1 ECU.1
N$8
  Bottom 0.406: IC1.3 23.6,74.07 23.6,70.74 24.4,69.94 26.13,69.94 R1.1 27.93,71.74 44.54,71.74 51.85,79.06 C2.1
N$9
  Bottom 0.406: C1.1 54.61,85.34 51.12,81.85 51.12,81.71 | 51.12,81.71 51.12,79.7 44.12,72.71 26.35,72.71 R2.1 | IC1.5 27.19,81.71 51.12,81.71
N$10
  Bottom 0.406: U$2.INT 59.69,38.71 49.87,28.89 R14.1
N$11
  Bottom 0.406: R21.1 67.31,20.32 | 67.31,20.32 D4.C | D3.A 68.58,21.59 67.31,20.32
N$12
  Bottom 0.406: R17.1 91.4,7.3 86.04,12.66 D2.A
N$13
  Bottom 0.406: IC1.2 R12.2 R7.1
N$14
  Bottom 0.406: R18.1 93.03,9.21 R19.1 96.2,9.21 97.79,7.62 Q5.1
N$15
  Bottom 0.406: T2.C 89.53,20.32 R18.2
N$16
  Bottom 0.406: R20.1 R13.2 IC1.6
N$17
  Bottom 0.406: R30.1 48.7,85.22 50.96,87.47 50.96,90.33 53.02,92.39 74.93,92.39 79.58,87.74 79.58,67.74 D5.C 83.5,63.27 85.5,61.28 88.28,61.28 90.5,63.5 K1.S2
N$18
  Bottom 0.406: R13.1 18.41,85.41 IC1.7 21.59,81.76 23.66,79.69 40.96,79.69 R31.2
N$19
  Bottom 4.445: K3.11 94.9,88.85 ENGINE_CUTOFF_CONN.2
N$20
  Bottom 4.445: K3.14 100.97,83.87 101,83.84 ENGINE_CUTOFF_CONN.1
N$21
  Bottom 0.406: 103.5,6.35 Q5.3
  Bottom 0.508: R19.2 102.9,9.18 102.9,6.38 Q5.3
  Bottom 2.032: FUSE.1 103.5,6.35
N$22
  Bottom 0.813: T3.C 67.31,74.93 70.48,78.1 D7.A 71.3,78.1 74.51,81.31 K3.A1
N$23
  Bottom 0.813: D8.A 74.05,67.31 K2.A1 74.93,67.76 T4.C
N$25
  Bottom 0.305: 58.85,52.39 57.26,53.98 57.26,58.2 58.43,59.37
  Bottom 0.406: R33.1 58.85,52.39 | 58.43,59.37 69.22,59.37 T4.B
N$26
  Bottom 0.356: 56.65,51.94 56.41,52.17 56.41,58.74 58,60.33 63.5,60.33
  Bottom 0.406: T3.B 64.77,61.59 63.5,60.33 | R32.1 58.74,49.85 56.65,51.94
N$27
  Bottom 4.445: K2.11 100.31,75.53 102.19,77.42 CLAXON_CONN.2
N$28
  Bottom 4.445: K2.14 101.11,67.97 105.55,72.41 CLAXON_CONN.1
PWR_ENABLE
  Bottom 0.406: R21.2 52.54,20.32 45.1,27.76 45.1,31.94 U$1.D23
PWR_IN+  (via drill 1)
  Top 0.813: v80.33,58.23 v80.33,14.61
  Bottom 0.508: IC1.8 C4.1 14.29,86.04 15.44,87.2 28.69,87.2 32.39,83.5 49.53,83.5 52.49,86.46 52.49,89.64 53.87,91.02 72.44,91.02 74.27,89.19 | 74.68,75.56 K2.A2
  Bottom 0.813: 73.98,88.9 74.68,88.9 K3.A2 77.47,86.11 77.47,78.35 74.68,75.56 74.05,74.93 D8.C | 74.27,89.19 73.98,88.9 | 73.98,88.9 D7.C | K2.A2 77.47,72.78 77.47,61.09 v80.33,58.23 | v80.33,14.61 80.33,13.02 83.63,9.71 U$4.IN+
  Bottom 1.016: 100.65,6.67 Q5.2
  Bottom 1.524: JP_PWR_12V.2 100.65,6.67
  Bottom 1.905: Q5.2 100.33,3.77 99.63,3.1 87.06,3.1 U$4.IN+
SD_CS
  Bottom 0.406: U$1.D15 15.23,26.74 20.36,21.61 U$5.CS
SENS_APP_0_IN
  Bottom 0.406: R11.1 44.45,53.02 41.28,53.02 R10.2 39.37,55.08 38.09,56.36 U$1.D34
SENS_APP_1_IN
  Bottom 0.406: R9.1 45.92,51.96 39.8,51.96 R8.2 39.21,52.39 35.55,56.05 U$1.D35
SPI_CS_1
  Bottom 0.406: U$1.D22 43.17,28.14 49.85,21.46 JP_SPI_1.5
SPI_MISO
  Bottom 0.406: R24.2 R25.2 U$1.D13
SPI_MISO_5V
  Bottom 0.406: U$2.SO 67.31,38.73 56.27,27.69 56.27,14.9 52.83,11.46 JP_SPI_1.1 49.24,11.46 47.97,12.72 46.01,12.72 45.56,13.18 37.32,13.18 U$5.MISO 35,15.49 17.46,15.49 6.79,26.16 6.79,34.7 11.26,39.17 R24.1
SPI_MOSI
  Bottom 0.406: U$1.D12 17.77,44.34 7.76,34.34 7.76,26.87 18.1,16.53 U$5.MOSI 38.84,14.19 47.11,14.19 JP_SPI_1.4 47.89,13.99 49.16,12.72 52.18,12.72 55.33,15.88 55.33,29.3 U$2.SI
SPI_SCK
  Bottom 0.406: U$1.D14 20.36,57.9 20.36,45.61 8.59,33.84 8.59,27.67 18.78,17.48 34.91,17.48 U$5.SCK 40.31,15.26 48.17,15.26 49.44,13.99 JP_SPI_1.3 51.54,13.99 54.41,16.87 54.41,30.3 62.23,38.12 U$2.SCK
UART0_RX
  Bottom 0.406: U$1.D3 38.09,32.23 39.69,30.63 39.69,22.78 42.56,19.91 JP_UART0.3
UART0_TX
  Bottom 0.406: U$1.D1 40.82,32.36 40.82,24.19 42.56,22.45 JP_UART0.2
UART2_RX
  Bottom 0.406: R29.2 22.85,27.24 U$1.D16 23.17,32.55 32.07,41.45 R16.2
UART2_TX
  Bottom 0.305: 51.16,49.01 51.16,62.87
  Bottom 0.406: U$1.D17 25.39,33.19 31.38,39.18 R22.1 32,39.16 36.22,43.37 45.52,43.37 51.16,49.01
  Bottom 1.27: Q1.S 51.16,62.87

### Text on the board
tNames: 5V | CAR COMPUTER | SCL | S. Jansen v1 | SDA | SWITCH0 | GND | I2C | 5V | RX | GPS | TX | SWITCH1 | GND | 3V | GND | +3V3 | GND | 5V | GND | 5V | BUTTONS | +3V3 | GND | H | TX | UART0 | RX | IGN | 5V | GND | L | GND | CS | MOSI | BAT | SCK | GND | 12V | 5V | MISO | SPI | TERMINATOR / RESISTOR | +V | -V | 12V | GND | CAN H | CAN L